# Altium schematic sheet Charger.SchDoc
size A
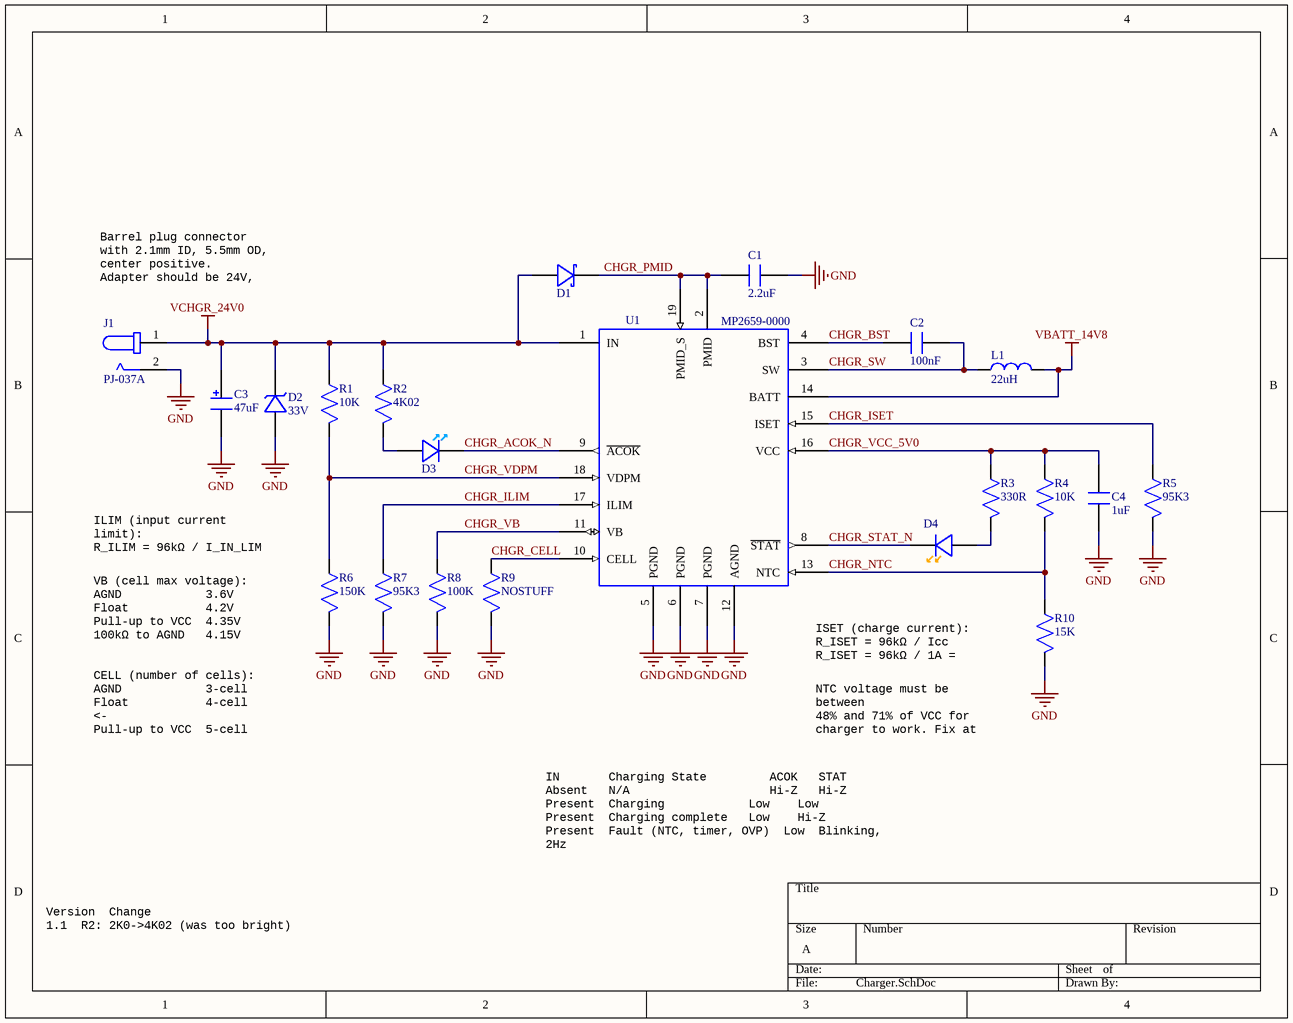
[diagram p0: Charger.SchDoc]

## Parts
C1  Capacitance: 2.2uF  [1206_CAP]
C2  Capacitance: 100nF  [0603_CAP]
C3  Capacitance: 47uF  [CAP_RADIAL_5MMx11MM]
C4  Capacitance: 1uF  [0603_CAP]
D1  *  [DO-214AC_SMA]  (value not drawn)
D2  Reverse Standoff Voltage: 33V  [DO-214AC_SMA]  (hidden comment: *)
D3  *  [LED_1411]  (value not drawn)
D4  *  [LED_1411]  (value not drawn)
J1  Part Number: PJ-037A  [CONN_BARREL_PLUG_PJ-037A]  (hidden comment: *)
L1  Inductance: 22uH  [IND_AMRM00101040220MA1]
R1  Resistance: 10K  [0603_RES]
R2  Resistance: 4K02  [0603_RES]
R3  Resistance: 330R  [0603_RES]
R4  Resistance: 10K  [0603_RES]
R5  Resistance: 95K3  [0603_RES]
R6  Resistance: 150K  [0603_RES]
R7  Resistance: 95K3  [0603_RES]
R8  Resistance: 100K  [0603_RES]
R9  (no value)  [0603_RES]
R10  Resistance: 15K  [0603_RES]
U1  Part Number: MP2659-0000  [QFN-19]

## Nets
GND: C1.1 C3.2 C4.1 D2.2 J1.2 R5.1 R6.1 R7.1 R8.1 R9.1 R10.1 U1.5(PGND) U1.6(PGND) U1.7(PGND) U1.12(AGND)
VBATT_14V8: L1.2 U1.14(BATT)
VCHGR_24V0: C3.1 D1.2 D2.1 J1.1 R1.2 R2.2 U1.1(IN)
CHGR_ACOK_N: D3.1 U1.9(~{ACOK})
CHGR_BST: C2.2 U1.4(BST)
CHGR_CELL: R9.2 U1.10(CELL)
CHGR_ILIM: R7.2 U1.17(ILIM)
CHGR_ISET: R5.2 U1.15(ISET)
CHGR_NTC: R4.1 R10.2 U1.13(NTC)
CHGR_PMID: C1.2 D1.1 U1.2(PMID) U1.19(PMID_S)
CHGR_STAT_N: D4.1 U1.8(~{STAT})
CHGR_SW: C2.1 L1.1 U1.3(SW)
CHGR_VB: R8.2 U1.11(VB)
CHGR_VCC_5V0: C4.2 R3.2 R4.2 U1.16(VCC)
CHGR_VDPM: R1.1 R6.2 U1.18(VDPM)
NetD3_2: D3.2 R2.1
NetD4_2: D4.2 R3.1

## Notes on the sheet
- Barrel plug connector with 2.1mm ID, 5.5mm OD, center positive.
  Adapter should be 24V, 1A+.
- ILIM (input current limit):
  R_ILIM = 96kΩ / I_IN_LIM
  R_ILIM = 96kΩ / 1A = 96kΩ
- VB (cell max voltage):
  AGND            3.6V
  Float           4.2V
  Pull-up to VCC  4.35V
  100kΩ to AGND   4.15V <-
- ISET (charge current):
  R_ISET = 96kΩ / Icc
  R_ISET = 96kΩ / 1A = 96kΩ
- CELL (number of cells):
  AGND            3-cell
  Float           4-cell <-
  Pull-up to VCC  5-cell
  100kΩ to AGND   6-cell
- (near R10) NTC voltage must be between
  48% and 71% of VCC for
  charger to work. Fix at 60%
  with 10kΩ/15kΩ divider.
- IN       Charging State      	  ACOK   STAT
  Absent   N/A                 	  Hi-Z   Hi-Z
  Present  Charging         	  Low    Low
  Present  Charging complete	  Low    Hi-Z
  Present  Fault (NTC, timer, OVP)  Low	 Blinking, 2Hz
  Present  Regulation mode          Low    Blinking, 1Hz
- Version		Change
  1.1		R2: 2K0->4K02 (was too bright)

## Library data of the parts
C1 = CAP_1206_2.2uF: Manufacturer: Samsung Electro-Mechanics; Part Number: CL31B225KBHNFNE; Tolerance: 10%; Voltage: 50V; Dielectric: X7R; Case: 1206
C2 = CAP_0603_100nF: Manufacturer: Samsung Electro-Mechanics; Part Number: CL10B104KB8NNWC; Tolerance: 10%; Voltage: 50V; Dielectric: X7R
C3 = CAP_RADIAL_47uF: Manufacturer: Würth Elektronik; Part Number: 860020572006; Tolerance: 20%; Voltage: 35V; Case: Radial, Can
C4 = CAP_0603_1uF: Manufacturer: Samsung Electro-Mechanics; Part Number: CL10B105KA8NNNC; Tolerance: 10%; Voltage: 25V; Dielectric: X7R
D1 = DIODE_SCHOTTKY_40V_2A: Manufacturer: Diodes Incorporated; Part Number: B240AE-13; Max Reverse Voltage: 40V; Average Forward Current: 2A; Package: DO-214AC_SMA
D2 = DIODE_TVS_33V_UNIDIR: Manufacturer: Diodes Incorporated; Part Number: SMAJ33AQ-13-F; Package: DO-214AC_SMA
D3 = LED_BLUE_150141BS73100: Manufacturer: Würth Elektronik; Part Number: 150141BS73100; Package: SMD 1411
D4 = LED_AMBER_150141AS73100: Manufacturer: Würth Elektronik; Part Number: 150141AS73100; Package: SMD 1411
J1 = CONN_BARREL_PLUG_PJ-037A: Manufacturer: CUI Devices; Mating Diameter: 2.1mm ID, 5.5mm OD; Max Current: 2.5A; Rated Voltage: 24V
L1 = IND_AMRM00101040220MA1_22U0: Manufacturer: Pulse Electronics; DCR: 0.066Ohm; Saturation Current: 5A; Tolerance: 20%; Part Number: AMRM00101040220MA1
R1 R4 = RES_0603_10K: Manufacturer: Stackpole Electronics Inc; Part Number: RMCF0603FT10K0; Tolerance: 1%; Temperature Coefficient: 100ppm; Power Rating: 0.1W
R2 = RES_0603_4K02: Manufacturer: Stackpole Electronics Inc; Part Number: RMCF0603FT4K02; Tolerance: 1%; Temperature Coefficient: 100ppm; Power Rating: 0.1W
R3 = RES_0603_330R: Manufacturer: Stackpole Electronics Inc; Part Number: RMCF0603FT330R; Tolerance: 1%; Temperature Coefficient: 100ppm; Power Rating: 0.1W
R5 R7 = RES_0603_95K3: Manufacturer: Stackpole Electronics Inc.; Part Number: RMCF0603FT95K3; Tolerance: 1%; Power Rating: 0.1W; Temperature Coefficient: 100ppm
R6 = RES_0603_150K: Manufacturer: Stackpole Electronics Inc; Part Number: RMCF0603FG150K; Tolerance: 1%; Temperature Coefficient: 100ppm; Power Rating: 0.1W
R8 = RES_0603_100K: Manufacturer: Stackpole; Part Number: RMCF0603FT100K; Tolerance: 1%; Temperature Coefficient: 100ppm; Power Rating: 0.1W
R9 = RES_0603_NOSTUFF: Manufacturer: *; Part Number: *; Resistance: *; Tolerance: *; NOSTUFF: NOSTUFF
R10 = RES_0603_15K: Manufacturer: Stackpole Electronics Inc; Part Number: RMCF0603FG15K0; Tolerance: 1%; Power Rating: 0.1W; Temperature Coefficient: 100ppm
U1 = MP2659: Manufacturer: Monolithic Power Systems; Package: QFN-19